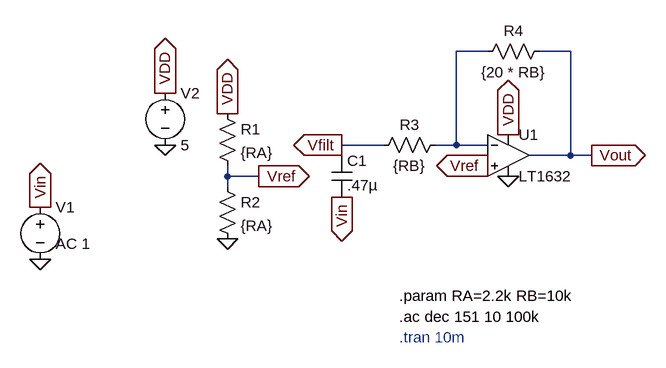
[diagram p0: schematic amplifier_lab.asc]
amplifier_lab.asc, the LTspice schematic file:
Version 4.1
SHEET 1 880 680
WIRE 272 48 224 48
WIRE 400 48 352 48
WIRE 112 192 48 192
WIRE 224 192 224 48
WIRE 224 192 192 192
WIRE 272 192 224 192
WIRE 48 208 48 192
WIRE 400 208 400 48
WIRE 400 208 336 208
WIRE 432 208 400 208
WIRE -128 240 -128 224
WIRE -80 240 -128 240
WIRE -128 256 -128 240
FLAG 304 240 0
FLAG -416 368 0
FLAG -416 288 Vin
IOPIN -416 288 Out
FLAG -128 336 0
FLAG -128 144 VDD
IOPIN -128 144 Out
FLAG -80 240 Vref
IOPIN -80 240 Out
FLAG 272 224 Vref
IOPIN 272 224 Out
FLAG -224 192 0
FLAG -224 112 VDD
IOPIN -224 112 Out
FLAG 48 272 Vin
IOPIN 48 272 Out
FLAG 304 176 VDD
IOPIN 304 176 Out
FLAG 432 208 Vout
IOPIN 432 208 Out
FLAG 48 192 Vfilt
IOPIN 48 192 Out
SYMBOL OpAmps\\LT1632 304 144 R0
SYMATTR InstName U1
SYMBOL voltage -416 272 R0
WINDOW 3 24 44 Left 2
WINDOW 123 24 72 Left 2
WINDOW 39 0 0 Left 0
SYMATTR Value ""
SYMATTR Value2 AC 1
SYMATTR InstName V1
SYMBOL res -144 128 R0
SYMATTR InstName R1
SYMATTR Value {RA}
SYMBOL res -144 240 R0
SYMATTR InstName R2
SYMATTR Value {RA}
SYMBOL res 208 176 R90
WINDOW 0 0 56 VBottom 2
WINDOW 3 32 56 VTop 2
SYMATTR InstName R3
SYMATTR Value {RB}
SYMBOL res 368 32 R90
WINDOW 0 0 56 VBottom 2
WINDOW 3 32 56 VTop 2
SYMATTR InstName R4
SYMATTR Value {20 * RB}
SYMBOL voltage -224 96 R0
WINDOW 123 0 0 Left 0
WINDOW 39 0 0 Left 0
SYMATTR InstName V2
SYMATTR Value 5
SYMBOL cap 32 208 R0
WINDOW 3 24 46 Left 2
SYMATTR Value .47µ
SYMATTR InstName C1
TEXT 136 424 Left 2 !.param RA=2.2k RB=10k
TEXT 136 456 Left 2 !.ac dec 151 10 100k
TEXT 136 488 Left 2 ;.tran 10m

The netlist it stands for:
* amplifier_lab.asc
X§U1 Vref N001 VDD 0 Vout LT1632  ; pins In+ In- V+ V- OUT
V1 Vin 0 AC 1
R1 VDD Vref {RA}
R2 Vref 0 {RA}
R3 N001 Vfilt {RB}
R4 Vout N001 {20 * RB}
V2 VDD 0 5
C1 Vfilt Vin .47µ
.param RA=2.2k RB=10k
.ac dec 151 10 100k
* .tran 10m
.lib LTC.lib
.backanno
.end